# Altium project DSD_PLC_SMALL.PrjPCB
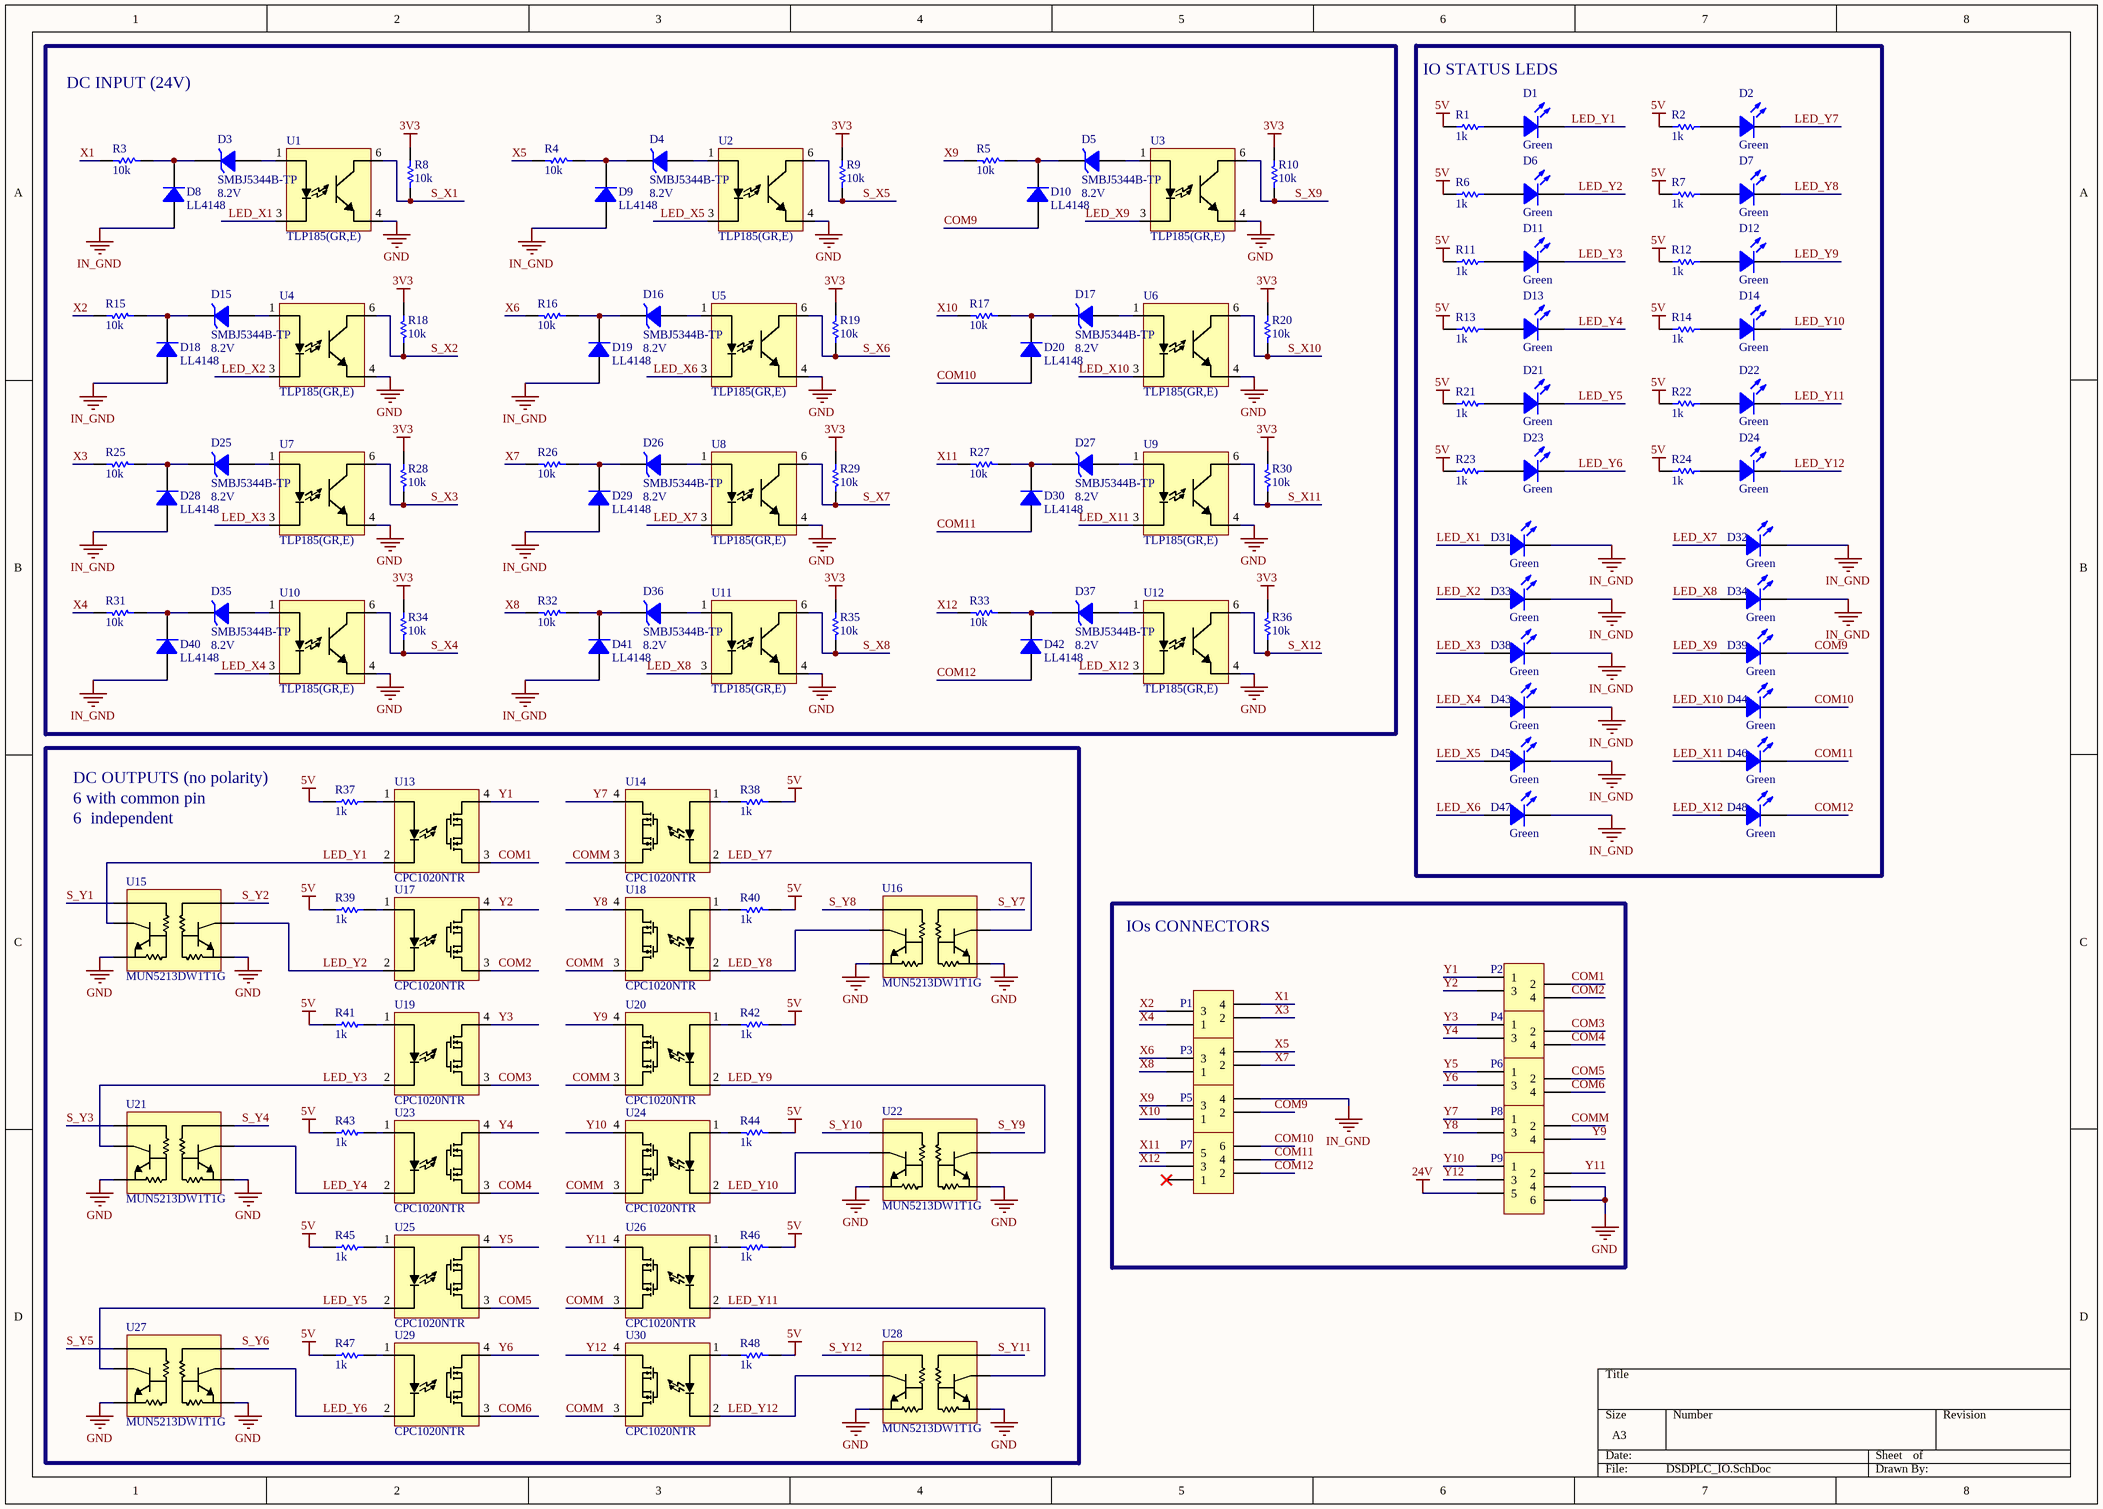
[diagram p0: DSDPLC_IO.SchDoc]
2 sheets, 165 parts. Net scope: global (net labels, ports and power ports of the same name join across sheets).
Board file: DSD_PLC_SMALL.PcbDoc
Sheets:
  DSDPLC_IO.SchDoc
  DSDPLC_MCU.SchDoc

## Sheet DSDPLC_IO.SchDoc: DSD_PLC
size A3; Author: Nicolás Velásquez; CompanyName: DeepSea Developments

### Parts
D1  Green  [R0603_N]
D2  Green  [R0603_N]
D3  SMBJ5344B-TP  Voltage - Zener (Nom) (Vz): 8.2V  [SMB_N]
D4  SMBJ5344B-TP  Voltage - Zener (Nom) (Vz): 8.2V  [SMB_N]
D5  SMBJ5344B-TP  Voltage - Zener (Nom) (Vz): 8.2V  [SMB_N]
D6  Green  [R0603_N]
D7  Green  [R0603_N]
D8  LL4148  [SOD-80_N]
D9  LL4148  [SOD-80_N]
D10  LL4148  [SOD-80_N]
D11  Green  [R0603_N]
D12  Green  [R0603_N]
D13  Green  [R0603_N]
D14  Green  [R0603_N]
D15  SMBJ5344B-TP  Voltage - Zener (Nom) (Vz): 8.2V  [SMB_N]
D16  SMBJ5344B-TP  Voltage - Zener (Nom) (Vz): 8.2V  [SMB_N]
D17  SMBJ5344B-TP  Voltage - Zener (Nom) (Vz): 8.2V  [SMB_N]
D18  LL4148  [SOD-80_N]
D19  LL4148  [SOD-80_N]
D20  LL4148  [SOD-80_N]
D21  Green  [R0603_N]
D22  Green  [R0603_N]
D23  Green  [R0603_N]
D24  Green  [R0603_N]
D25  SMBJ5344B-TP  Voltage - Zener (Nom) (Vz): 8.2V  [SMB_N]
D26  SMBJ5344B-TP  Voltage - Zener (Nom) (Vz): 8.2V  [SMB_N]
D27  SMBJ5344B-TP  Voltage - Zener (Nom) (Vz): 8.2V  [SMB_N]
D28  LL4148  [SOD-80_N]
D29  LL4148  [SOD-80_N]
D30  LL4148  [SOD-80_N]
D31  Green  [R0603_N]
D32  Green  [R0603_N]
D33  Green  [R0603_N]
D34  Green  [R0603_N]
D35  SMBJ5344B-TP  Voltage - Zener (Nom) (Vz): 8.2V  [SMB_N]
D36  SMBJ5344B-TP  Voltage - Zener (Nom) (Vz): 8.2V  [SMB_N]
D37  SMBJ5344B-TP  Voltage - Zener (Nom) (Vz): 8.2V  [SMB_N]
D38  Green  [R0603_N]
D39  Green  [R0603_N]
D40  LL4148  [SOD-80_N]
D41  LL4148  [SOD-80_N]
D42  LL4148  [SOD-80_N]
D43  Green  [R0603_N]
D44  Green  [R0603_N]
D45  Green  [R0603_N]
D46  Green  [R0603_N]
D47  Green  [R0603_N]
D48  Green  [R0603_N]
P1  BLOCK_CONN2X2  [block_conn 2 x 2]  (value not drawn)
P2  BLOCK_CONN2X2  [block_conn 2 x 2]  (value not drawn)
P3  BLOCK_CONN2X2  [block_conn 2 x 2]  (value not drawn)
P4  BLOCK_CONN2X2  [block_conn 2 x 2]  (value not drawn)
P5  BLOCK_CONN2X2  [block_conn 2 x 2]  (value not drawn)
P6  BLOCK_CONN2X2  [block_conn 2 x 2]  (value not drawn)
P7  BLOCK_CONN2X3  [block_conn 2 x 3]  (value not drawn)
P8  BLOCK_CONN2X2  [block_conn 2 x 2]  (value not drawn)
P9  BLOCK_CONN2X3  [block_conn 2 x 3]  (value not drawn)
R1  value 1k  [R0603_N]  (hidden comment: R_SMD)
R2  value 1k  [R0603_N]  (hidden comment: R_SMD)
R3  value 10k  [R0603_N]  (hidden comment: R_SMD)
R4  value 10k  [R0603_N]  (hidden comment: R_SMD)
R5  value 10k  [R0603_N]  (hidden comment: R_SMD)
R6  value 1k  [R0603_N]  (hidden comment: R_SMD)
R7  value 1k  [R0603_N]  (hidden comment: R_SMD)
R8  value 10k  [R0603_N]  (hidden comment: R_SMD)
R9  value 10k  [R0603_N]  (hidden comment: R_SMD)
R10  value 10k  [R0603_N]  (hidden comment: R_SMD)
R11  value 1k  [R0603_N]  (hidden comment: R_SMD)
R12  value 1k  [R0603_N]  (hidden comment: R_SMD)
R13  value 1k  [R0603_N]  (hidden comment: R_SMD)
R14  value 1k  [R0603_N]  (hidden comment: R_SMD)
R15  value 10k  [R0603_N]  (hidden comment: R_SMD)
R16  value 10k  [R0603_N]  (hidden comment: R_SMD)
R17  value 10k  [R0603_N]  (hidden comment: R_SMD)
R18  value 10k  [R0603_N]  (hidden comment: R_SMD)
R19  value 10k  [R0603_N]  (hidden comment: R_SMD)
R20  value 10k  [R0603_N]  (hidden comment: R_SMD)
R21  value 1k  [R0603_N]  (hidden comment: R_SMD)
R22  value 1k  [R0603_N]  (hidden comment: R_SMD)
R23  value 1k  [R0603_N]  (hidden comment: R_SMD)
R24  value 1k  [R0603_N]  (hidden comment: R_SMD)
R25  value 10k  [R0603_N]  (hidden comment: R_SMD)
R26  value 10k  [R0603_N]  (hidden comment: R_SMD)
R27  value 10k  [R0603_N]  (hidden comment: R_SMD)
R28  value 10k  [R0603_N]  (hidden comment: R_SMD)
R29  value 10k  [R0603_N]  (hidden comment: R_SMD)
R30  value 10k  [R0603_N]  (hidden comment: R_SMD)
R31  value 10k  [R0603_N]  (hidden comment: R_SMD)
R32  value 10k  [R0603_N]  (hidden comment: R_SMD)
R33  value 10k  [R0603_N]  (hidden comment: R_SMD)
R34  value 10k  [R0603_N]  (hidden comment: R_SMD)
R35  value 10k  [R0603_N]  (hidden comment: R_SMD)
R36  value 10k  [R0603_N]  (hidden comment: R_SMD)
R37  value 1k  [R0603_N]  (hidden comment: R_SMD)
R38  value 1k  [R0603_N]  (hidden comment: R_SMD)
R39  value 1k  [R0603_N]  (hidden comment: R_SMD)
R40  value 1k  [R0603_N]  (hidden comment: R_SMD)
R41  value 1k  [R0603_N]  (hidden comment: R_SMD)
R42  value 1k  [R0603_N]  (hidden comment: R_SMD)
R43  value 1k  [R0603_N]  (hidden comment: R_SMD)
R44  value 1k  [R0603_N]  (hidden comment: R_SMD)
R45  value 1k  [R0603_N]  (hidden comment: R_SMD)
R46  value 1k  [R0603_N]  (hidden comment: R_SMD)
R47  value 1k  [R0603_N]  (hidden comment: R_SMD)
R48  value 1k  [R0603_N]  (hidden comment: R_SMD)
U1  TLP185(GR,E)  [SOIC6 (4 leads)]
U2  TLP185(GR,E)  [SOIC6 (4 leads)]
U3  TLP185(GR,E)  [SOIC6 (4 leads)]
U4  TLP185(GR,E)  [SOIC6 (4 leads)]
U5  TLP185(GR,E)  [SOIC6 (4 leads)]
U6  TLP185(GR,E)  [SOIC6 (4 leads)]
U7  TLP185(GR,E)  [SOIC6 (4 leads)]
U8  TLP185(GR,E)  [SOIC6 (4 leads)]
U9  TLP185(GR,E)  [SOIC6 (4 leads)]
U10  TLP185(GR,E)  [SOIC6 (4 leads)]
U11  TLP185(GR,E)  [SOIC6 (4 leads)]
U12  TLP185(GR,E)  [SOIC6 (4 leads)]
U13  CPC1020NTR  [SOP4_N]
U14  CPC1020NTR  [SOP4_N]
U15  MUN5213DW1T1G  [SOT363_N]
U16  MUN5213DW1T1G  [SOT363_N]
U17  CPC1020NTR  [SOP4_N]
U18  CPC1020NTR  [SOP4_N]
U19  CPC1020NTR  [SOP4_N]
U20  CPC1020NTR  [SOP4_N]
U21  MUN5213DW1T1G  [SOT363_N]
U22  MUN5213DW1T1G  [SOT363_N]
U23  CPC1020NTR  [SOP4_N]
U24  CPC1020NTR  [SOP4_N]
U25  CPC1020NTR  [SOP4_N]
U26  CPC1020NTR  [SOP4_N]
U27  MUN5213DW1T1G  [SOT363_N]
U28  MUN5213DW1T1G  [SOT363_N]
U29  CPC1020NTR  [SOP4_N]
U30  CPC1020NTR  [SOP4_N]

### Blocks framed on the sheet
DC INPUT (24V): D3-D5 D8-D10 D15-D20 D25-D30 D35-D37 D40-D42 R3-R5 R8-R10 R15-R20 R25-R36 U1-U12
IO STATUS LEDS: D1 D2 D6 D7 D11-D14 D21-D24 D31-D34 D38 D39 D43-D48 R1 R2 R6 R7 R11-R14 R21-R24
IOs CONNECTORS: P1-P9

### Nets
3V3: R8.2 R9.2 R10.2 R18.2 R19.2 R20.2 R28.2 R29.2 R30.2 R34.2 R35.2 R36.2
5V: R1.1 R2.1 R6.1 R7.1 R11.1 R12.1 R13.1 R14.1 R21.1 R22.1 R23.1 R24.1 R37.2 R38.2 R39.2 R40.2 R41.2 R42.2 R43.2 R44.2 R45.2 R46.2 R47.2 R48.2
24V: P9.5
GND: P9.4 P9.6 U1.4(DC-) U2.4(DC-) U3.4(DC-) U4.4(DC-) U5.4(DC-) U6.4(DC-) U7.4(DC-) U8.4(DC-) U9.4(DC-) U10.4(DC-) U11.4(DC-) U12.4(DC-) U15.1 U15.4 U16.1 U16.4 U21.1 U21.4 U22.1 U22.4 U27.1 U27.4 U28.1 U28.4
IN_GND: D8.1(A) D9.1(A) D18.1(A) D19.1(A) D28.1(A) D29.1(A) D31.2(K) D32.2(K) D33.2(K) D34.2(K) D38.2(K) D40.1(A) D41.1(A) D43.2(K) D45.2(K) D47.2(K) P5.4
COM1: P2.2 U13.3(DC-)
COM2: P2.4 U17.3(DC-)
COM3: P4.2 U19.3(DC-)
COM4: P4.4 U23.3(DC-)
COM5: P6.2 U25.3(DC-)
COM6: P6.4 U29.3(DC-)
COM9: D10.1(A) D39.2(K) P5.2
COM10: D20.1(A) D44.2(K) P7.6
COM11: D30.1(A) D46.2(K) P7.4
COM12: D42.1(A) D48.2(K) P7.2
COMM: P8.2 U14.3(DC-) U18.3(DC-) U20.3(DC-) U24.3(DC-) U26.3(DC-) U30.3(DC-)
LED_X1: D31.1(A) U1.3(control-)
LED_X2: D33.1(A) U4.3(control-)
LED_X3: D38.1(A) U7.3(control-)
LED_X4: D43.1(A) U10.3(control-)
LED_X5: D45.1(A) U2.3(control-)
LED_X6: D47.1(A) U5.3(control-)
LED_X7: D32.1(A) U8.3(control-)
LED_X8: D34.1(A) U11.3(control-)
LED_X9: D39.1(A) U3.3(control-)
LED_X10: D44.1(A) U6.3(control-)
LED_X11: D46.1(A) U9.3(control-)
LED_X12: D48.1(A) U12.3(control-)
LED_Y1: D1.2(K) U13.2(control-) U15.6(b)
LED_Y2: D6.2(K) U15.3 U17.2(control-)
LED_Y3: D11.2(K) U19.2(control-) U21.6(b)
LED_Y4: D13.2(K) U21.3 U23.2(control-)
LED_Y5: D21.2(K) U25.2(control-) U27.6(b)
LED_Y6: D23.2(K) U27.3 U29.2(control-)
LED_Y7: D2.2(K) U14.2(control-) U16.6(b)
LED_Y8: D7.2(K) U16.3 U18.2(control-)
LED_Y9: D12.2(K) U20.2(control-) U22.6(b)
LED_Y10: D14.2(K) U22.3 U24.2(control-)
LED_Y11: D22.2(K) U26.2(control-) U28.6(b)
LED_Y12: D24.2(K) U28.3 U30.2(control-)
S_X1: R8.1 U1.6(DC+)
S_X2: R18.1 U4.6(DC+)
S_X3: R28.1 U7.6(DC+)
S_X4: R34.1 U10.6(DC+)
S_X5: R9.1 U2.6(DC+)
S_X6: R19.1 U5.6(DC+)
S_X7: R29.1 U8.6(DC+)
S_X8: R35.1 U11.6(DC+)
S_X9: R10.1 U3.6(DC+)
S_X10: R20.1 U6.6(DC+)
S_X11: R30.1 U9.6(DC+)
S_X12: R36.1 U12.6(DC+)
S_Y1: U15.2
S_Y2: U15.5
S_Y3: U21.2
S_Y4: U21.5
S_Y5: U27.2
S_Y6: U27.5
S_Y7: U16.2
S_Y8: U16.5
S_Y9: U22.2
S_Y10: U22.5
S_Y11: U28.2
S_Y12: U28.5
X1: P1.4 R3.2
X2: P1.3 R15.2
X3: P1.2 R25.2
X4: P1.1 R31.2
X5: P3.4 R4.2
X6: P3.3 R16.2
X7: P3.2 R26.2
X8: P3.1 R32.2
X9: P5.3 R5.2
X10: P5.1 R17.2
X11: P7.5 R27.2
X12: P7.3 R33.2
Y1: P2.1 U13.4(DC+)
Y2: P2.3 U17.4(DC+)
Y3: P4.1 U19.4(DC+)
Y4: P4.3 U23.4(DC+)
Y5: P6.1 U25.4(DC+)
Y6: P6.3 U29.4(DC+)
Y7: P8.1 U14.4(DC+)
Y8: P8.3 U18.4(DC+)
Y9: P8.4 U20.4(DC+)
Y10: P9.1 U24.4(DC+)
Y11: P9.2 U26.4(DC+)
Y12: P9.3 U30.4(DC+)
NetD1_1: D1.1(A) R1.2
NetD2_1: D2.1(A) R2.2
NetD3_1: D3.1(A) U1.1(control+)
NetD3_2: D3.2(K) D8.2(K) R3.1
NetD4_1: D4.1(A) U2.1(control+)
NetD4_2: D4.2(K) D9.2(K) R4.1
NetD5_1: D5.1(A) U3.1(control+)
NetD5_2: D5.2(K) D10.2(K) R5.1
NetD6_1: D6.1(A) R6.2
NetD7_1: D7.1(A) R7.2
NetD11_1: D11.1(A) R11.2
NetD12_1: D12.1(A) R12.2
NetD13_1: D13.1(A) R13.2
NetD14_1: D14.1(A) R14.2
NetD15_1: D15.1(A) U4.1(control+)
NetD15_2: D15.2(K) D18.2(K) R15.1
NetD16_1: D16.1(A) U5.1(control+)
NetD16_2: D16.2(K) D19.2(K) R16.1
NetD17_1: D17.1(A) U6.1(control+)
NetD17_2: D17.2(K) D20.2(K) R17.1
NetD21_1: D21.1(A) R21.2
NetD22_1: D22.1(A) R22.2
NetD23_1: D23.1(A) R23.2
NetD24_1: D24.1(A) R24.2
NetD25_1: D25.1(A) U7.1(control+)
NetD25_2: D25.2(K) D28.2(K) R25.1
NetD26_1: D26.1(A) U8.1(control+)
NetD26_2: D26.2(K) D29.2(K) R26.1
NetD27_1: D27.1(A) U9.1(control+)
NetD27_2: D27.2(K) D30.2(K) R27.1
NetD35_1: D35.1(A) U10.1(control+)
NetD35_2: D35.2(K) D40.2(K) R31.1
NetD36_1: D36.1(A) U11.1(control+)
NetD36_2: D36.2(K) D41.2(K) R32.1
NetD37_1: D37.1(A) U12.1(control+)
NetD37_2: D37.2(K) D42.2(K) R33.1
NetR37_1: R37.1 U13.1(control+)
NetR38_1: R38.1 U14.1(control+)
NetR39_1: R39.1 U17.1(control+)
NetR40_1: R40.1 U18.1(control+)
NetR41_1: R41.1 U19.1(control+)
NetR42_1: R42.1 U20.1(control+)
NetR43_1: R43.1 U23.1(control+)
NetR44_1: R44.1 U24.1(control+)
NetR45_1: R45.1 U25.1(control+)
NetR46_1: R46.1 U26.1(control+)
NetR47_1: R47.1 U29.1(control+)
NetR48_1: R48.1 U30.1(control+)

Not connected (* = marked no-connect by the designer): P7 1*

### Notes on the sheet
- DC OUTPUTS (no polarity)
- 6 with common pin
- 6  independent

### Library data of the parts
D1 D2 D6 D7 D11-D14 D21-D24 D31-D34 D38 D39 D43-D48 = LED_SMD: Color: Green
D3-D5 D15-D17 D25-D27 D35-D37 = SMBJ5344B-TP: DIODE ZENER 8.2V 5W DO214AA; Manufacturer: Micro Commercial Co; Tolerance: ±5%; Impedance (Max) (Zzt): 1.5 Ohm; Current - Reverse Leakage @ Vr: 10µA @ 6.2V; Voltage - Forward (Vf) (Max) @ If: 1.2V @ 1A; Supplier 1: Digi-Key; Manufacturer Part Number: SMBJ5344B-TP; RoHS: RoHS Compliant; Category: Discrete Semiconductor Products; Stock 1: 15936; Pricing 1: 1=0.65, 10=0.57, 25=0.504, 100=0.4392, 250=0.38236, 500=0.32548, 1000=0.2607 (USD); Packaging: Cut Tape (CT); Power - Max: 5W; Operating Temperature: -55°C ~ 150°C; Mounting Type: Surface Mount; Package / Case: DO-214AA, SMB; Supplier Device Package: DO-214AA (SMB); ComponentLink1URL: http://www.mccsemi.com/up_pdf/SMBJ5338B-SMBJ5388B(SMB).pdf; ComponentLink1Description: http://www.mccsemi.com/up_pdf/SMBJ5338B-SMBJ5388B(SMB).pdf; Supplier Part Number 1: SMBJ5344B-TPMSCT-ND
D8-D10 D18-D20 D28-D30 D40-D42 = LL4148: DIODE SMALL SIG 100V 0.2A SOD80; Manufacturer: Fairchild Semiconductor; Diode Type: Standard; Current - Average Rectified (Io): 200mA; Voltage - Forward (Vf) (Max) @ If: 1V @ 10mA; Speed: Small Signal =< 200mA (Io), Any Speed; Reverse Recovery Time (trr): 4ns; Current - Reverse Leakage @ Vr: 25nA @ 20V; Capacitance @ Vr, F: 4pF @ 0V, 1MHz; Supplier 1: Digi-Key; Manufacturer Part Number: LL4148; RoHS: RoHS Compliant; Category: Discrete Semiconductor Products; Stock 1: 155674; Pricing 1: 1=0.1, 10=0.068, 25=0.062, 100=0.0445, 250=0.0262, 500=0.02174, 1000=0.01483 (USD); Packaging: Cut Tape (CT); Voltage - DC Reverse (Vr) (Max): 100V; Mounting Type: Surface Mount; Package / Case: SOD-80; Supplier Device Package: SOD-80; Operating Temperature - Junction: -55°C ~ 175°C; ComponentLink1URL: http://www.fairchildsemi.com/ds/LL/LL4148.pdf; ComponentLink1Description: http://www.fairchildsemi.com/ds/LL/LL4148.pdf; Supplier Part Number 1: LL4148FSCT-ND
P1-P6 P8 = BLOCK_CONN2X2: TERM BLOCK 2POS STACK 5.08MM PC; Manufacturer: TE Connectivity; Manufacturer Part Number: 796692-2; Number of Levels: 2; Pitch: 0.200" (5.08mm); Mating Orientation: Horizontal with Board; Current: 17.5A; Voltage: 300V; Wire Gauge: 12-30 AWG; Wire Termination: Screw - Rising Cage Clamp; Clamp Material - Plating: Brass - Tin Plated; Screw Material - Plating: Brass - Nickel Plated; Torque - Screw: 0.79 Nm (7.0 Lb-In); Screw Thread: M3; Supplier 1: Digi-Key; RoHS: RoHS Compliant; Category: Connectors, Interconnects; Stock 1: 978; Pricing 1: 1=2.66, 10=2.013, 25=1.866, 50=1.6778, 100=1.637, 250=1.43236, 500=1.30956, 1000=1.1868, 2500=1.06402 (USD); Packaging: Bulk; Positions Per Level: 2; Mounting Type: Through Hole; Features: Interlocking (Side); Color: Green; Operating Temperature: -; Housing Material: Polyamide (PA66), Nylon 6/6; Contact Material - Plating: Brass - Tin Plated; ComponentLink1URL: http://www.te.com/commerce/DocumentDelivery/DDEController?Action=srchrtrv&DocNm=796692&DocType=Customer+Drawing&DocLang=English; ComponentLink1Description: http://www.te.com/commerce/DocumentDelivery/DDEController?Action=srchrtrv&DocNm=796692&DocType=Customer+Drawing&DocLang=English; Supplier Part Number 1: A98450-ND
P7 P9 = BLOCK_CONN2X3: TERM BLOCK 3POS STACK 5.08MM PC; Manufacturer: TE Connectivity; Manufacturer Part Number: 796692-3; Number of Levels: 2; Positions Per Level: 3; Pitch: 0.200" (5.08mm); Mating Orientation: Horizontal with Board; Current: 17.5A; Voltage: 300V; Wire Gauge: 12-30 AWG; Wire Termination: Screw - Rising Cage Clamp; Clamp Material - Plating: Brass - Tin Plated; Screw Material - Plating: Brass - Nickel Plated; Torque - Screw: 0.79 Nm (7.0 Lb-In); Screw Thread: M3; Supplier 1: Digi-Key; RoHS: RoHS Compliant; Category: Connectors, Interconnects; Stock 1: 537; Pricing 1: 1=4.64, 25=3.312, 50=2.944, 100=2.88, 250=2.656, 500=2.4, 1000=2.128, 2500=2.04, 5000=2 (USD); Packaging: Bulk; Mounting Type: Through Hole; Features: Interlocking (Side); Color: Green; Operating Temperature: -; Housing Material: Polyamide (PA66), Nylon 6/6; Contact Material - Plating: Brass - Tin Plated; ComponentLink1URL: http://www.te.com/commerce/DocumentDelivery/DDEController?Action=srchrtrv&DocNm=796692&DocType=Customer+Drawing&DocLang=English; ComponentLink1Description: http://www.te.com/commerce/DocumentDelivery/DDEController?Action=srchrtrv&DocNm=796692&DocType=Customer+Drawing&DocLang=English; Supplier Part Number 1: A98266-ND
U1-U12 = TLP185(GR,E): OPTOISO 3.75KV TRANS 6-SO 4 LEAD; Manufacturer: Toshiba Semiconductor and Storage; Number of Channels: 1; Voltage - Isolation: 3750Vrms; Current Transfer Ratio (Min): 100% @ 5mA; Current Transfer Ratio (Max): 300% @ 5mA; Turn On / Turn Off Time (Typ): 9µs, 9µs; Rise / Fall Time (Typ): 5µs, 9µs; Input Type: DC; Output Type: Transistor; Voltage - Output (Max): 80V; Current - Output / Channel: 50mA; Voltage - Forward (Vf) (Typ): 1.25V; Vce Saturation (Max): 300mV; Supplier 1: Digi-Key; Manufacturer Part Number: TLP185(GR,E); RoHS: RoHS Compliant; Category: Isolators; Stock 1: 5555; Pricing 1: 1=0.53, 25=0.3412, 100=0.294, 250=0.26252, 500=0.22576, 1000=0.1743, 2500=0.1575, 5000=0.147 (USD); Packaging: Tube; Current - DC Forward (If) (Max): 50mA; Operating Temperature: -55°C ~ 110°C; Mounting Type: Surface Mount; Package / Case: 6-SMD (4 Leads), Gull Wing; Supplier Device Package: 6-SO, 4 Lead; ComponentLink1URL: http://www.semicon.toshiba.co.jp/docs/datasheet/en/Opto/TLP185_en_datasheet_120214.pdf; ComponentLink1Description: http://www.semicon.toshiba.co.jp/docs/datasheet/en/Opto/TLP185_en_datasheet_120214.pdf; Supplier Part Number 1: TLP185(GRE)-ND
U13 U14 U17-U20 U23-U26 U29 U30 = CPC1020NTR: RELAY OPTOMOS 1200MA 4-SOP; Manufacturer: IXYS Integrated Circuits Division; Circuit: SPST-NO (1 Form A); Output Type: AC, DC; On-State Resistance: 250 mOhm; Load Current: 1.2A; Voltage - Input: 1.2VDC; Voltage - Load: 0 ~ 30 V; Supplier 1: Digi-Key; Manufacturer Part Number: CPC1020NTR; RoHS: RoHS Compliant; Category: Relays; Stock 1: 34319; Pricing 1: 1=3.12, 10=2.808, 25=2.548, 100=2.288, 250=2.08, 500=1.82, 1000=1.56 (USD); Packaging: Cut Tape (CT); Mounting Type: Surface Mount; Termination Style: Gull Wing; Package / Case: 4-SOP (0.150", 3.81mm); Supplier Device Package: 4-SOP (2.54mm); Relay Type: Relay; ComponentLink1URL: http://www.clare.com/home/pdfs.nsf/www/CPC1020N.pdf/$file/CPC1020N.pdf; ComponentLink1Description: http://www.clare.com/home/pdfs.nsf/www/CPC1020N.pdf/$file/CPC1020N.pdf; Supplier Part Number 1: CLA318CT-ND
U15 U16 U21 U22 U27 U28 = MUN5213DW1T1G: TRANS PREBIAS DUAL NPN SOT363; Manufacturer: ON Semiconductor; Transistor Type: 2 NPN - Pre-Biased (Dual); Current - Collector (Ic) (Max): 100mA; Voltage - Collector Emitter Breakdown (Max): 50V; Resistor - Base (R1) (Ohms): 47k; DC Current Gain (hFE) (Min) @ Ic, Vce: 80 @ 5mA, 10V; Vce Saturation (Max) @ Ib, Ic: 250mV @ 300µA, 10mA; Current - Collector Cutoff (Max): 500nA; Power - Max: 250mW; Supplier 1: Digi-Key; Manufacturer Part Number: MUN5213DW1T1G; RoHS: RoHS Compliant; Category: Discrete Semiconductor Products; Stock 1: 9487; Pricing 1: 1=0.29, 10=0.265, 25=0.1908, 100=0.1485, 250=0.09332, 500=0.07952, 1000=0.05418 (USD); Packaging: Cut Tape (CT); Resistor - Emitter Base (R2) (Ohms): 47k; Frequency - Transition: -; Mounting Type: Surface Mount; Package / Case: 6-TSSOP, SC-88, SOT-363; Supplier Device Package: SC-88/SC70-6/SOT-363; ComponentLink1URL: http://www.onsemi.com/pub_link/Collateral/DTC144ED-D.PDF; ComponentLink1Description: http://www.onsemi.com/pub_link/Collateral/DTC144ED-D.PDF; Supplier Part Number 1: MUN5213DW1T1GOSCT-ND

## Sheet DSDPLC_MCU.SchDoc
size A3
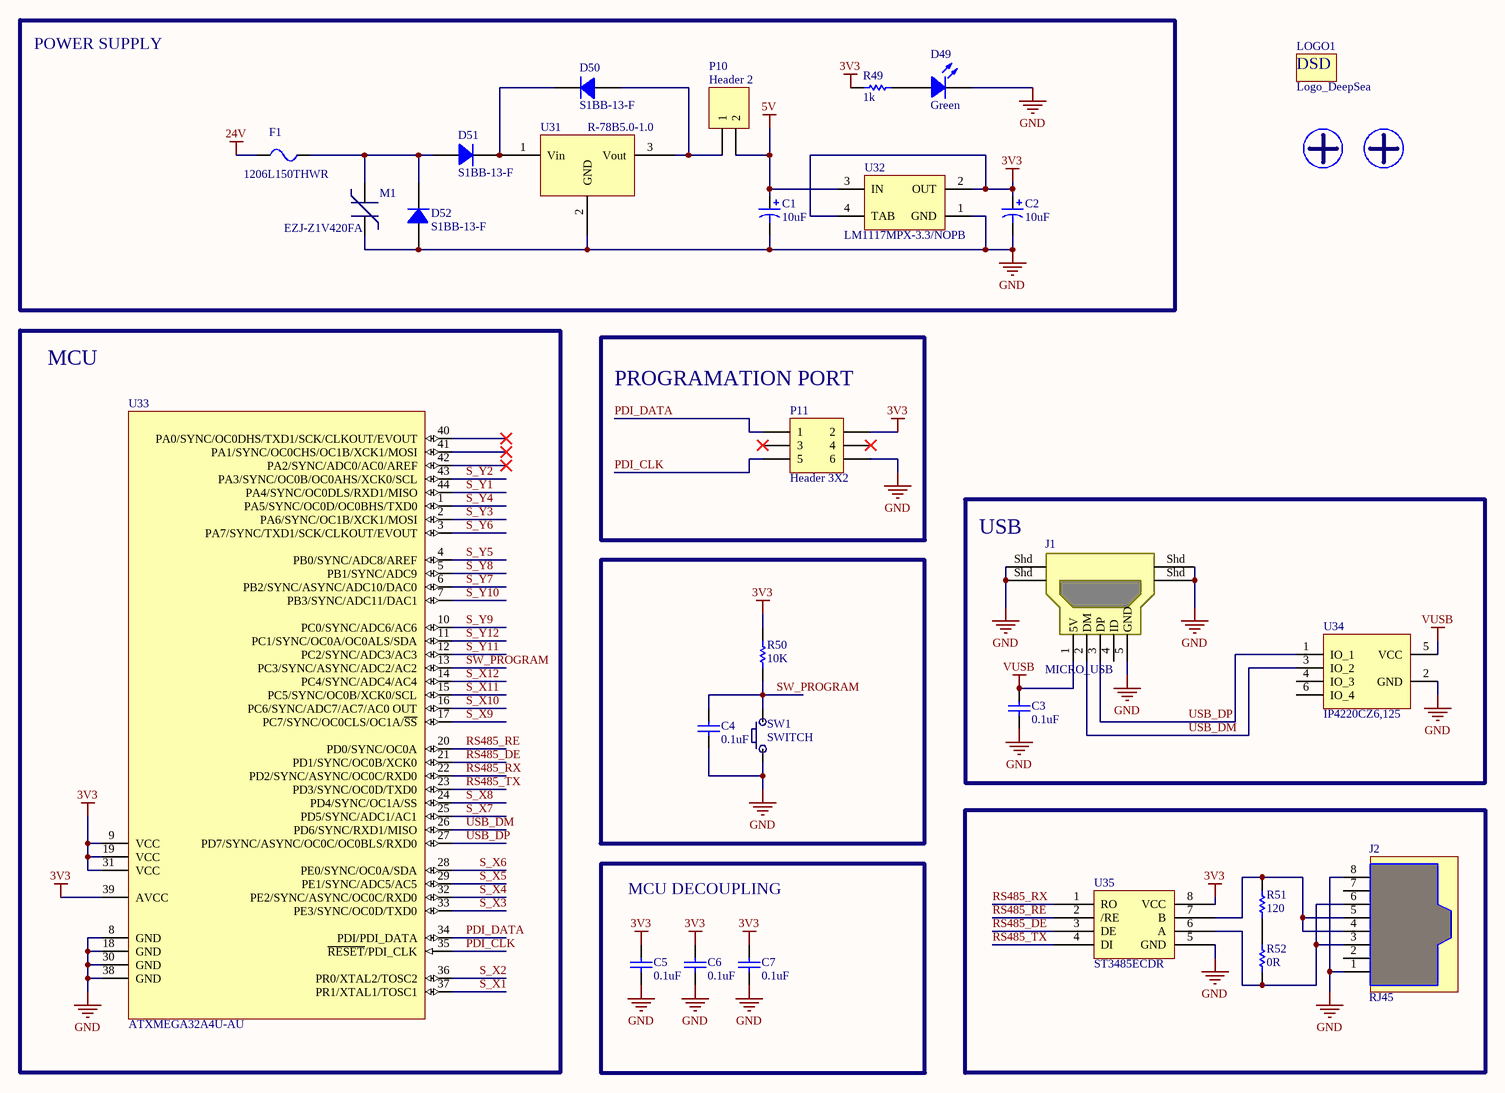
[diagram p1: DSDPLC_MCU.SchDoc]

### Parts
C1  10uF  [C_TANT_A_3216_N]
C2  10uF  [C_TANT_A_3216_N]
C3  0.1uF  [C0603_N]
C4  0.1uF  [C0603_N]
C5  0.1uF  [C0603_N]
C6  0.1uF  [C0603_N]
C7  0.1uF  [C0603_N]
D49  Green  [R0603_N]
D50  S1BB-13-F  [SMB_N]
D51  S1BB-13-F  [SMB_N]
D52  S1BB-13-F  [SMB_N]
F1  1206L150THWR  [R1206_N]
J1  MICRO_USB  [USB_MICRO_SMD]
J2  RJ45  [rj45]
LOGO1  Logo_DeepSea  [DeepSea_logo1]
M1  EZJ-Z1V420FA  [R0603_N]
M2  MountingHole-1/8in  [MoutingHole-1/8in]  (value not drawn)
M3  MountingHole-1/8in  [MoutingHole-1/8in]  (value not drawn)
P10  Header 2  [HDR1X2]
P11  Header 3X2  [HDR2X3]
R49  value 1k  [R0603_N]  (hidden comment: R_SMD)
R50  10K  [R0603_N]
R51  120  [R0603_N]
R52  0R  [R0603_N]
SW1  SWITCH  [swich_foot]
U31  R-78B5.0-1.0  [SIP3_RECOM]
U32  LM1117MPX-3.3/NOPB  [MP04A_N]
U33  ATXMEGA32A4U-AU  [44A_N]
U34  IP4220CZ6,125  [SOT457_N]
U35  ST3485ECDR  [SOIC8WA_N]

### Blocks framed on the sheet
POWER SUPPLY: C1 C2 D49-D52 F1 M1 P10 R49 U31 U32

### Nets
3V3: C2.1 C5.2 C6.2 C7.2 P11.2 R49.1 R50.2 U32.2(OUT) U32.4(TAB) U33.9(VCC) U33.19(VCC) U33.31(VCC) U33.39(AVCC) U35.8(VCC)
5V: C1.1 P10.2 U32.3(IN)
24V: F1.1
GND: C1.2 C2.2 C3.1 C4.2 C5.1 C6.1 C7.1 D49.2(K) D52.1(A) J1.5(GND) J1.Shd J2.1 J2.8 M1.2 P11.6 SW1.1 U31.2(GND) U32.1(GND) U33.8(GND) U33.18(GND) U33.30(GND) U33.38(GND) U34.2(GND) U35.5(GND)
VUSB: C3.2 J1.1(5V) U34.5(VCC)
PDI_CLK: P11.5 U33.35(~{RESET}/PDI_CLK)
PDI_DATA: P11.1 U33.34(PDI/PDI_DATA)
RS485_DE: U33.21(PD1/SYNC/OC0B/XCK0) U35.3(DE)
RS485_RE: U33.20(PD0/SYNC/OC0A) U35.2(/RE)
RS485_RX: U33.22(PD2/SYNC/ASYNC/OC0C/RXD0) U35.1(RO)
RS485_TX: U33.23(PD3/SYNC/OC0D/TXD0) U35.4(DI)
S_X1: U33.37(PR1/XTAL1/TOSC1)
S_X2: U33.36(PR0/XTAL2/TOSC2)
S_X3: U33.33(PE3/SYNC/OC0D/TXD0)
S_X4: U33.32(PE2/SYNC/ASYNC/OC0C/RXD0)
S_X5: U33.29(PE1/SYNC/ADC5/AC5)
S_X6: U33.28(PE0/SYNC/OC0A/SDA)
S_X7: U33.25(PD5/SYNC/ADC1/AC1)
S_X8: U33.24(PD4/SYNC/OC1A/SS)
S_X9: U33.17(PC7/SYNC/OC0CLS/OC1A/~{SS})
S_X10: U33.16(PC6/SYNC/ADC7/AC7/AC0_OUT)
S_X11: U33.15(PC5/SYNC/OC0B/XCK0/SCL)
S_X12: U33.14(PC4/SYNC/ADC4/AC4)
S_Y1: U33.44(PA4/SYNC/OC0DLS/RXD1/MISO)
S_Y2: U33.43(PA3/SYNC/OC0B/OC0AHS/XCK0/SCL)
S_Y3: U33.2(PA6/SYNC/OC1B/XCK1/MOSI)
S_Y4: U33.1(PA5/SYNC/OC0D/OC0BHS/TXD0)
S_Y5: U33.4(PB0/SYNC/ADC8/AREF)
S_Y6: U33.3(PA7/SYNC/TXD1/SCK/CLKOUT/EVOUT)
S_Y7: U33.6(PB2/SYNC/ASYNC/ADC10/DAC0)
S_Y8: U33.5(PB1/SYNC/ADC9)
S_Y9: U33.10(PC0/SYNC/ADC6/AC6)
S_Y10: U33.7(PB3/SYNC/ADC11/DAC1)
S_Y11: U33.12(PC2/SYNC/ADC3/AC3)
S_Y12: U33.11(PC1/SYNC/OC0A/OC0ALS/SDA)
SW_PROGRAM: C4.1 R50.1 SW1.2 U33.13(PC3/SYNC/ASYNC/ADC2/AC2)
USB_DM: J1.2(DM) U33.26(PD6/SYNC/RXD1/MISO) U34.3(IO_2)
USB_DP: J1.3(DP) U33.27(PD7/SYNC/ASYNC/OC0C/OC0BLS/RXD0) U34.1(IO_1)
NetD49_1: D49.1(A) R49.2
NetD50_1: D50.1(A) P10.1 U31.3(Vout)
NetD50_2: D50.2(K) D51.2(K) U31.1(Vin)
NetD51_1: D51.1(A) D52.2(K) F1.2 M1.1
NetJ2_3: J2.3 J2.6 R52.1 U35.6(A)
NetJ2_4: J2.4 J2.5 R51.2 U35.7(B)
NetR51_1: R51.1 R52.2

Not connected (* = marked no-connect by the designer): J1 4(ID); J2 2 7; P11 3* 4*; U33 40(PA0/SYNC/OC0DHS/TXD1/SCK/CLKOUT/EVOUT)* 41(PA1/SYNC/OC0CHS/OC1B/XCK1/MOSI)* 42(PA2/SYNC/ADC0/AC0/AREF)*; U34 4(IO_3) 6(IO_4)

### Notes on the sheet
- MCU
- (near P11) PROGRAMATION PORT
- (near J1) USB
- MCU DECOUPLING
- (in symbol Logo_DeepSea) DSD

### Library data of the parts
C1 C2 = CP_SMD: Value: 10uF
C3-C7 = C_SMD: Value: 0.1uF
D49 = LED_SMD: Color: Green
D50-D52 = S1BB-13-F: DIODE GEN PURPOSE 100V 1A SMB; Manufacturer: Diodes Incorporated; Diode Type: Standard; Voltage - Forward (Vf) (Max) @ If: 1.1V @ 1A; Speed: Standard Recovery >500ns, > 200mA (Io); Reverse Recovery Time (trr): 3µs; Current - Reverse Leakage @ Vr: 5µA @ 100V; Capacitance @ Vr, F: 10pF @ 4V, 1MHz; Supplier 1: Digi-Key; Manufacturer Part Number: S1BB-13-F; RoHS: RoHS Compliant; Category: Discrete Semiconductor Products; Stock 1: 11988; Pricing 1: 1=0.43, 10=0.306, 25=0.2416, 100=0.1836, 250=0.13004, 500=0.10404, 1000=0.078 (USD); Packaging: Cut Tape (CT); Voltage - DC Reverse (Vr) (Max): 100V; Current - Average Rectified (Io): 1A; Mounting Type: Surface Mount; Package / Case: DO-214AA, SMB; Supplier Device Package: SMB; Operating Temperature - Junction: -65°C ~ 150°C; ComponentLink1URL: http://www.diodes.com/datasheets/ds16003.pdf; ComponentLink1Description: http://www.diodes.com/datasheets/ds16003.pdf; Supplier Part Number 1: S1BB-FDICT-ND
F1 = 1206L150THWR: FUSE PTC RESET 8V 1.50A 1206; Manufacturer: Littelfuse Inc; Current - Max: 100A; Current - Hold (Ih) (Max): 1.5A; Current - Trip (It): 3A; R Min/Max: 0.040 ~ 0.120 Ohm; Time to Trip: 0.3s; Supplier 1: Digi-Key; Manufacturer Part Number: 1206L150THWR; RoHS: RoHS Compliant; Category: Circuit Protection; Stock 1: 8140; Pricing 1: 1=0.49, 10=0.462, 25=0.4256, 50=0.3892, 100=0.3234, 250=0.294, 500=0.2492, 1000=0.2198 (USD); Packaging: Cut Tape (CT); Voltage - Max: 8V; Package / Case: 1206 (3216 Metric), Concave, Long Side Terminals; ComponentLink1URL: http://www.littelfuse.com/~/media/electronics/datasheets/resettable_ptcs/littelfuse_ptc_1206l_datasheet.pdf.pdf; ComponentLink1Description: http://www.littelfuse.com/~/media/electronics/datasheets/resettable_ptcs/littelfuse_ptc_1206l_datasheet.pdf.pdf; Supplier Part Number 1: F3372CT-ND
J1 = MICRO_USB: CONN USB MICRO B RECPT SMT R/A; Manufacturer: FCI; Manufacturer Part Number: 10118194-0001LF; Connector Type: USB - micro B; Number of Contacts: 5; Gender: Receptacle; Specifications: USB 2.0; Supplier 1: Digi-Key; RoHS: RoHS Compliant; Category: Connectors, Interconnects; Stock 1: 9139; Pricing 1: 1=0.46, 10=0.433, 25=0.3712, 50=0.3156, 100=0.3032, 250=0.27224, 500=0.25988 (USD); Packaging: Cut Tape (CT); Mounting Type: Surface Mount, Right Angle, Horizontal; Features: Shielded, Solder Retention; Ingress Protection: -; ComponentLink1URL: http://portal.fciconnect.com/Comergent//fci/drawing/10118194.pdf; ComponentLink1Description: http://portal.fciconnect.com/Comergent//fci/drawing/10118194.pdf; Supplier Part Number 1: 609-4618-1-ND
J2 = RJ45: CONN MOD JACK R/A 8P8C SHIELDED; Manufacturer: TE Connectivity; Manufacturer Part Number: 5555153-1; Number of Positions/Contacts: 8p8c (RJ45, Ethernet); Number of Ports: 1; Ratings: Cat3; LED Color: Does Not Contain LED; Tab Direction: Down; Supplier 1: Digi-Key; RoHS: RoHS Compliant; Category: Connectors, Interconnects; Stock 1: 4543; Pricing 1: 1=1.82, 10=1.649, 50=1.481, 100=1.4136, 250=1.279, 500=1.17804, 1000=1.00974, 2500=0.94242, 5000=0.8953 (USD); Packaging: Tray; Connector Type: Jack; Number of Rows: 1; Mounting Type: Through Hole; Orientation: 90° Angle (Right); Termination: Solder; Shielding: Shielded; Features: Board Lock, Panel Stops; Ingress Protection: -; Contact Material: Phosphor Bronze; Contact Finish: Gold; Contact Finish Thickness: 50µin (1.27µm); Housing Material: Polybutylene Terephthalate (PBT), Polyester; Operating Temperature: -40°C ~ 85°C; ComponentLink1URL: http://www.te.com/commerce/DocumentDelivery/DDEController?Action=srchrtrv&DocNm=5555153&DocType=Customer+Drawing&DocLang=English; ComponentLink1Description: http://www.te.com/commerce/DocumentDelivery/DDEController?Action=srchrtrv&DocNm=5555153&DocType=Customer+Drawing&DocLang=English; Supplier Part Number 1: A31438-ND
M1 = EZJ-Z1V420FA: VARISTOR 42V 15A 0603; Manufacturer: Panasonic Electronic Components; Number of Circuits: 1; Maximum DC Volts: 30VDC; Supplier 1: Digi-Key; Manufacturer Part Number: EZJ-Z1V420FA; RoHS: RoHS Compliant; Category: Circuit Protection; Stock 1: 5765; Pricing 1: 1=0.35, 10=0.195, 100=0.1203, 500=0.09778, 1000=0.08797 (USD); Packaging: Cut Tape (CT); Varistor Voltage (Min): 42V; Current - Surge: 15A; Maximum AC Volts: -; Energy: -; Package / Case: 0603 (1608 Metric); ComponentLink1URL: http://industrial.panasonic.com/www-cgi/jvcr13pz.cgi?E+PZ+3+AWC0002+EZJZ1V420FA+7+WW; ComponentLink1Description: http://industrial.panasonic.com/www-cgi/jvcr13pz.cgi?E+PZ+3+AWC0002+EZJZ1V420FA+7+WW; Supplier Part Number 1: P13699CT-ND
P10 = Header 2: Header, 2-Pin; LatestRevisionDate: 17-Jul-2002; LatestRevisionNote: Re-released for DXP Platform.; Publisher: Altium Limited
P11 = Header 3X2: Header, 3-Pin, Dual row; LatestRevisionDate: 17-Jul-2002; LatestRevisionNote: Re-released for DXP Platform.; Publisher: Altium Limited
R50-R52 = R_SMD
  R50: Value: 10K
  R51: Value: 120
  R52: Value: 0R
SW1 = SWITCH: SWITCH TACTILE SPST-NO 0.05A 12V; Manufacturer: TE Connectivity; Manufacturer Part Number: FSM4JSMATR; Switch Function: Off-Mom; Contact Rating @ Voltage: 0.05A @ 12VDC; Actuator Type: Standard; Actuator Height off PCB, from Pins: 5.00mm; Actuator Orientation: Top Actuated; Outline: 6.00mm x 6.00mm; Illumination: Non-Illuminated; Operating Force: 160gf; Actuator Material: Polyphenylene Sulfide (PPS); Switch Travel: 0.25mm; Mechanical Life: 100,000 Cycles; Supplier 1: Digi-Key; RoHS: RoHS Compliant; Category: Switches; Stock 1: 33712; Pricing 1: 1=0.23, 10=0.223, 25=0.2136, 50=0.2038, 100=0.1843, 250=0.1698, 500=0.15524 (USD); Packaging: Cut Tape (CT); Circuit: SPST-NO; Mounting Type: Surface Mount; Termination Style: Gull Wing; Illumination Voltage (Nominal): -; Illumination Type, Color: -; Ingress Protection: -; Features: -; Operating Temperature: -35°C ~ 85°C; ComponentLink1URL: http://www.te.com/commerce/DocumentDelivery/DDEController?Action=srchrtrv&DocNm=2-1437565-7&DocType=Customer+Drawing&DocLang=English; ComponentLink1Description: http://www.te.com/commerce/DocumentDelivery/DDEController?Action=srchrtrv&DocNm=2-1437565-7&DocType=Customer+Drawing&DocLang=English; Supplier Part Number 1: 450-1759-1-ND
U31 = R-78B5.0-1.0: CONV DC/DC 1A 5V OUT SIP VERT; Manufacturer: Recom Power; Power (Watts) - Manufacture Series: 5W; Number of Outputs: 1; Voltage - Input (Min): 6.5V; Voltage - Input (Max): 32V; Efficiency: 93%; Supplier 1: Digi-Key; Manufacturer Part Number: R-78B5.0-1.0; RoHS: RoHS Compliant; Category: Power Supplies - Board Mount; Stock 1: 2864; Pricing 1: 1=8.45, 5=8.384, 10=8.32, 42=8.1919, 84=7.93595, 126=7.16802, 250=7.04 (USD); Packaging: Tube; Type: Linear Regulator Replacement; Voltage - Output 1: 5V; Voltage - Output 2: -; Voltage - Output 3: -; Current - Output (Max): 1A; Voltage - Isolation: -; Features: OTP, SCP; Mounting Type: Through Hole; Package / Case: 3-SIP Module; Size / Dimension: 0.45" L x 0.33" W x 0.69" H (11.5mm x 8.5mm x 17.5mm); Operating Temperature: -40°C ~ 85°C; Power (Watts) - Max: 5W; ComponentLink1URL: http://www.recom-power.com/pdf/Innoline/R-78Bxx-1.0_L.pdf; ComponentLink1Description: http://www.recom-power.com/pdf/Innoline/R-78Bxx-1.0_L.pdf; Supplier Part Number 1: 945-1052-ND
U32 = LM1117MPX-3.3/NOPB: 800mA Low-Dropout Linear Regulator, 4-pin SOT-223, Pb-Free; Manufacturer: National Semiconductor; PackageTopMarking: XYTT*N05A; PowerWise: N; CompType: LDO IC; Published: 1-Mar-2010; DatasheetVersion: Apr-2006; PackageVersion: revB, Apr-2003; PackageReference: MP04A; Publisher: Altium Limited; PackageDescription: Molded SOT-223, 6.50 x 3.56 x 1.6mm Body, 4 Lead, 2.3mm Pitch; Supplier 1: Digi-Key; Supplier Part Number 1: LM1117MPX-3.3TR-ND; Supplier 2: Digi-Key; Supplier Part Number 2: LM1117MPX-3.3CT-ND; Supplier 3: Digi-Key; Supplier Part Number 3: LM1117MPX-3.3DKR-ND; PartNumber: LM1117MPX-3.3/NOPB; RoHS: Y; PinCount: 4; Code_JEDEC: TO-261-AA; Code_IPC: SOT223-4; ComponentLink1Description: LM1117 Datasheet; ComponentLink1URL: http://www.national.com/ds/LM/LM1117.pdf; ComponentLink2Description: LM1117 Web Page; ComponentLink2URL: http://www.national.com/pf/LM/LM1117.html; ComponentLink3Description: MP04A Package Page; ComponentLink3URL: http://www.national.com/packaging/folders/mp04a.html
U33 = ATXMEGA32A4U-AU: IC MCU 8BIT 32KB FLASH 44TQFP; Manufacturer: Atmel; Core Processor: AVR; Core Size: 8/16-Bit; Speed: 32MHz; Connectivity: I²C, IrDA, SPI, UART/USART, USB; Peripherals: Brown-out Detect/Reset, DMA, POR, PWM, WDT; Number of I /O: 34; Program Memory Size: 32KB (16K x 16); EEPROM Size: 2K x 8; RAM Size: 4K x 8; Voltage - Supply (Vcc/Vdd): 1.6 V ~ 3.6 V; Data Converters: A/D 12x12b, D/A 2x12b; Oscillator Type: Internal; Supplier 1: Digi-Key; RoHS: RoHS Compliant; Category: Integrated Circuits (ICs); Stock 1: 2077; Pricing 1: 1=3.43, 25=2.1548, 100=1.9152 (USD); Packaging: Tray; Program Memory Type: FLASH; Operating Temperature: -40°C ~ 85°C; Package / Case: 44-TQFP; ComponentLink1URL: http://www.atmel.com/Images/Atmel-8387-8-and16-bit-AVR-Microcontroller-XMEGA-A4U_Datasheet.pdf; ComponentLink1Description: http://www.atmel.com/Images/Atmel-8387-8-and16-bit-AVR-Microcontroller-XMEGA-A4U_Datasheet.pdf; Supplier Part Number 1: ATXMEGA32A4U-AU-ND; Manufacturer Part Number: ATXMEGA32A4U-AU
U34 = IP4220CZ6,125: IC USB DUAL ESD PROTECT 6TSOP; Manufacturer: NXP Semiconductors; Voltage - Working: 5.5V; Number of Circuits: 4; Supplier 1: Digi-Key; Manufacturer Part Number: IP4220CZ6,125; RoHS: RoHS Compliant; Category: Circuit Protection; Stock 1: 1333; Pricing 1: 1=0.54, 10=0.42, 25=0.3544, 100=0.2888, 250=0.2392, 500=0.1976, 1000=0.148 (USD); Packaging: Cut Tape (CT); Voltage - Clamping: -; Technology: Mixed Technology; Power (Watts): -; Applications: USB; Package / Case: SC-74, SOT-457; Supplier Device Package: 6-TSOP; ComponentLink1URL: http://www.nxp.com/documents/data_sheet/IP4220CZ6.pdf; ComponentLink1Description: http://www.nxp.com/documents/data_sheet/IP4220CZ6.pdf; Supplier Part Number 1: 568-3529-1-ND
U35 = ST3485ECDR: TXRX RS485/422 3.3V ESD 8-SOIC; Manufacturer: STMicroelectronics; Protocol: RS422, RS485; Number of Drivers/Receivers: 1/1; Duplex: Half; Receiver Hysteresis: 70mV; Data Rate: 15Mbps; Voltage - Supply: 3 V ~ 3.6 V; Supplier 1: Digi-Key; Manufacturer Part Number: ST3485ECDR; RoHS: RoHS Compliant; Category: Integrated Circuits (ICs); Stock 1: 2539; Pricing 1: 1=2.44, 10=2.206, 25=1.9764, 100=1.7772, 250=1.578, 500=1.37884, 1000=1.11899 (USD); Packaging: Cut Tape (CT); Type: Transceiver; Operating Temperature: 0°C ~ 70°C; Mounting Type: Surface Mount; Package / Case: 8-SOIC (0.154", 3.90mm Width); Supplier Device Package: 8-SO; ComponentLink1URL: http://www.st.com/web/en/resource/technical/document/datasheet/CD00003137.pdf; ComponentLink1Description: http://www.st.com/web/en/resource/technical/document/datasheet/CD00003137.pdf; Supplier Part Number 1: 497-6540-1-ND

## Nets that join several sheets
3V3: DSDPLC_IO (12 pins), DSDPLC_MCU (14 pins)
5V: DSDPLC_IO (24 pins), DSDPLC_MCU (C1.1 P10.2 U32.3)
24V: DSDPLC_IO (P9.5), DSDPLC_MCU (F1.1)
GND: DSDPLC_IO (26 pins), DSDPLC_MCU (24 pins)
S_X1: DSDPLC_IO (R8.1 U1.6), DSDPLC_MCU (U33.37)
S_X2: DSDPLC_IO (R18.1 U4.6), DSDPLC_MCU (U33.36)
S_X3: DSDPLC_IO (R28.1 U7.6), DSDPLC_MCU (U33.33)
S_X4: DSDPLC_IO (R34.1 U10.6), DSDPLC_MCU (U33.32)
S_X5: DSDPLC_IO (R9.1 U2.6), DSDPLC_MCU (U33.29)
S_X6: DSDPLC_IO (R19.1 U5.6), DSDPLC_MCU (U33.28)
S_X7: DSDPLC_IO (R29.1 U8.6), DSDPLC_MCU (U33.25)
S_X8: DSDPLC_IO (R35.1 U11.6), DSDPLC_MCU (U33.24)
S_X9: DSDPLC_IO (R10.1 U3.6), DSDPLC_MCU (U33.17)
S_X10: DSDPLC_IO (R20.1 U6.6), DSDPLC_MCU (U33.16)
S_X11: DSDPLC_IO (R30.1 U9.6), DSDPLC_MCU (U33.15)
S_X12: DSDPLC_IO (R36.1 U12.6), DSDPLC_MCU (U33.14)
S_Y1: DSDPLC_IO (U15.2), DSDPLC_MCU (U33.44)
S_Y2: DSDPLC_IO (U15.5), DSDPLC_MCU (U33.43)
S_Y3: DSDPLC_IO (U21.2), DSDPLC_MCU (U33.2)
S_Y4: DSDPLC_IO (U21.5), DSDPLC_MCU (U33.1)
S_Y5: DSDPLC_IO (U27.2), DSDPLC_MCU (U33.4)
S_Y6: DSDPLC_IO (U27.5), DSDPLC_MCU (U33.3)
S_Y7: DSDPLC_IO (U16.2), DSDPLC_MCU (U33.6)
S_Y8: DSDPLC_IO (U16.5), DSDPLC_MCU (U33.5)
S_Y9: DSDPLC_IO (U22.2), DSDPLC_MCU (U33.10)
S_Y10: DSDPLC_IO (U22.5), DSDPLC_MCU (U33.7)
S_Y11: DSDPLC_IO (U28.2), DSDPLC_MCU (U33.12)
S_Y12: DSDPLC_IO (U28.5), DSDPLC_MCU (U33.11)